# Altium project MotorESC.PrjPcb
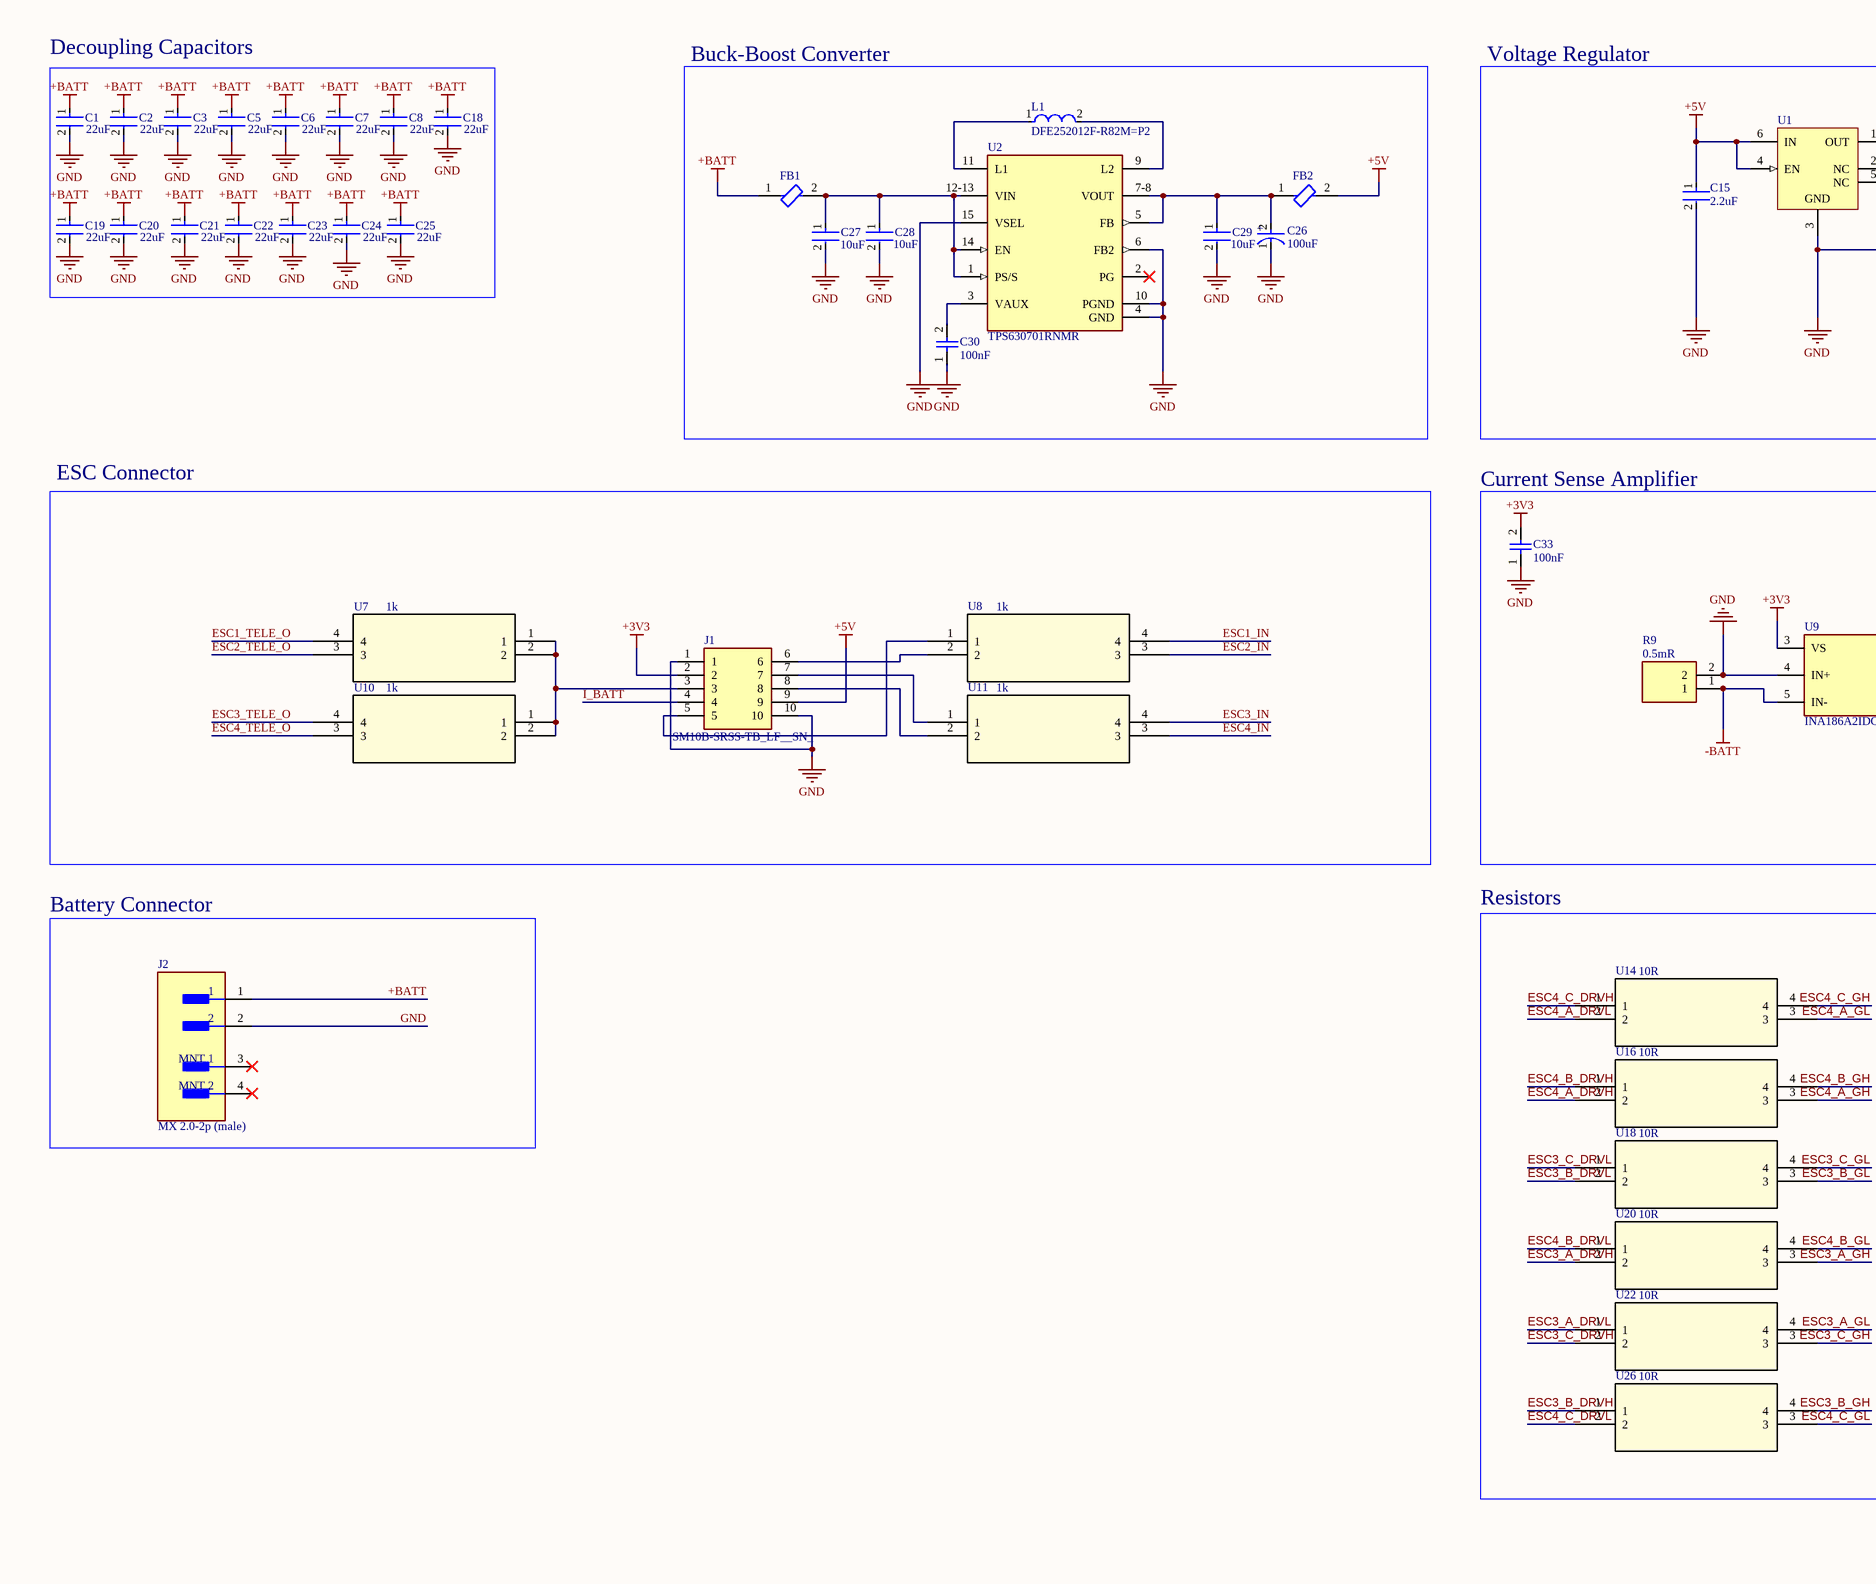
[diagram p0: ESC_Schematic.SchDoc, top left]
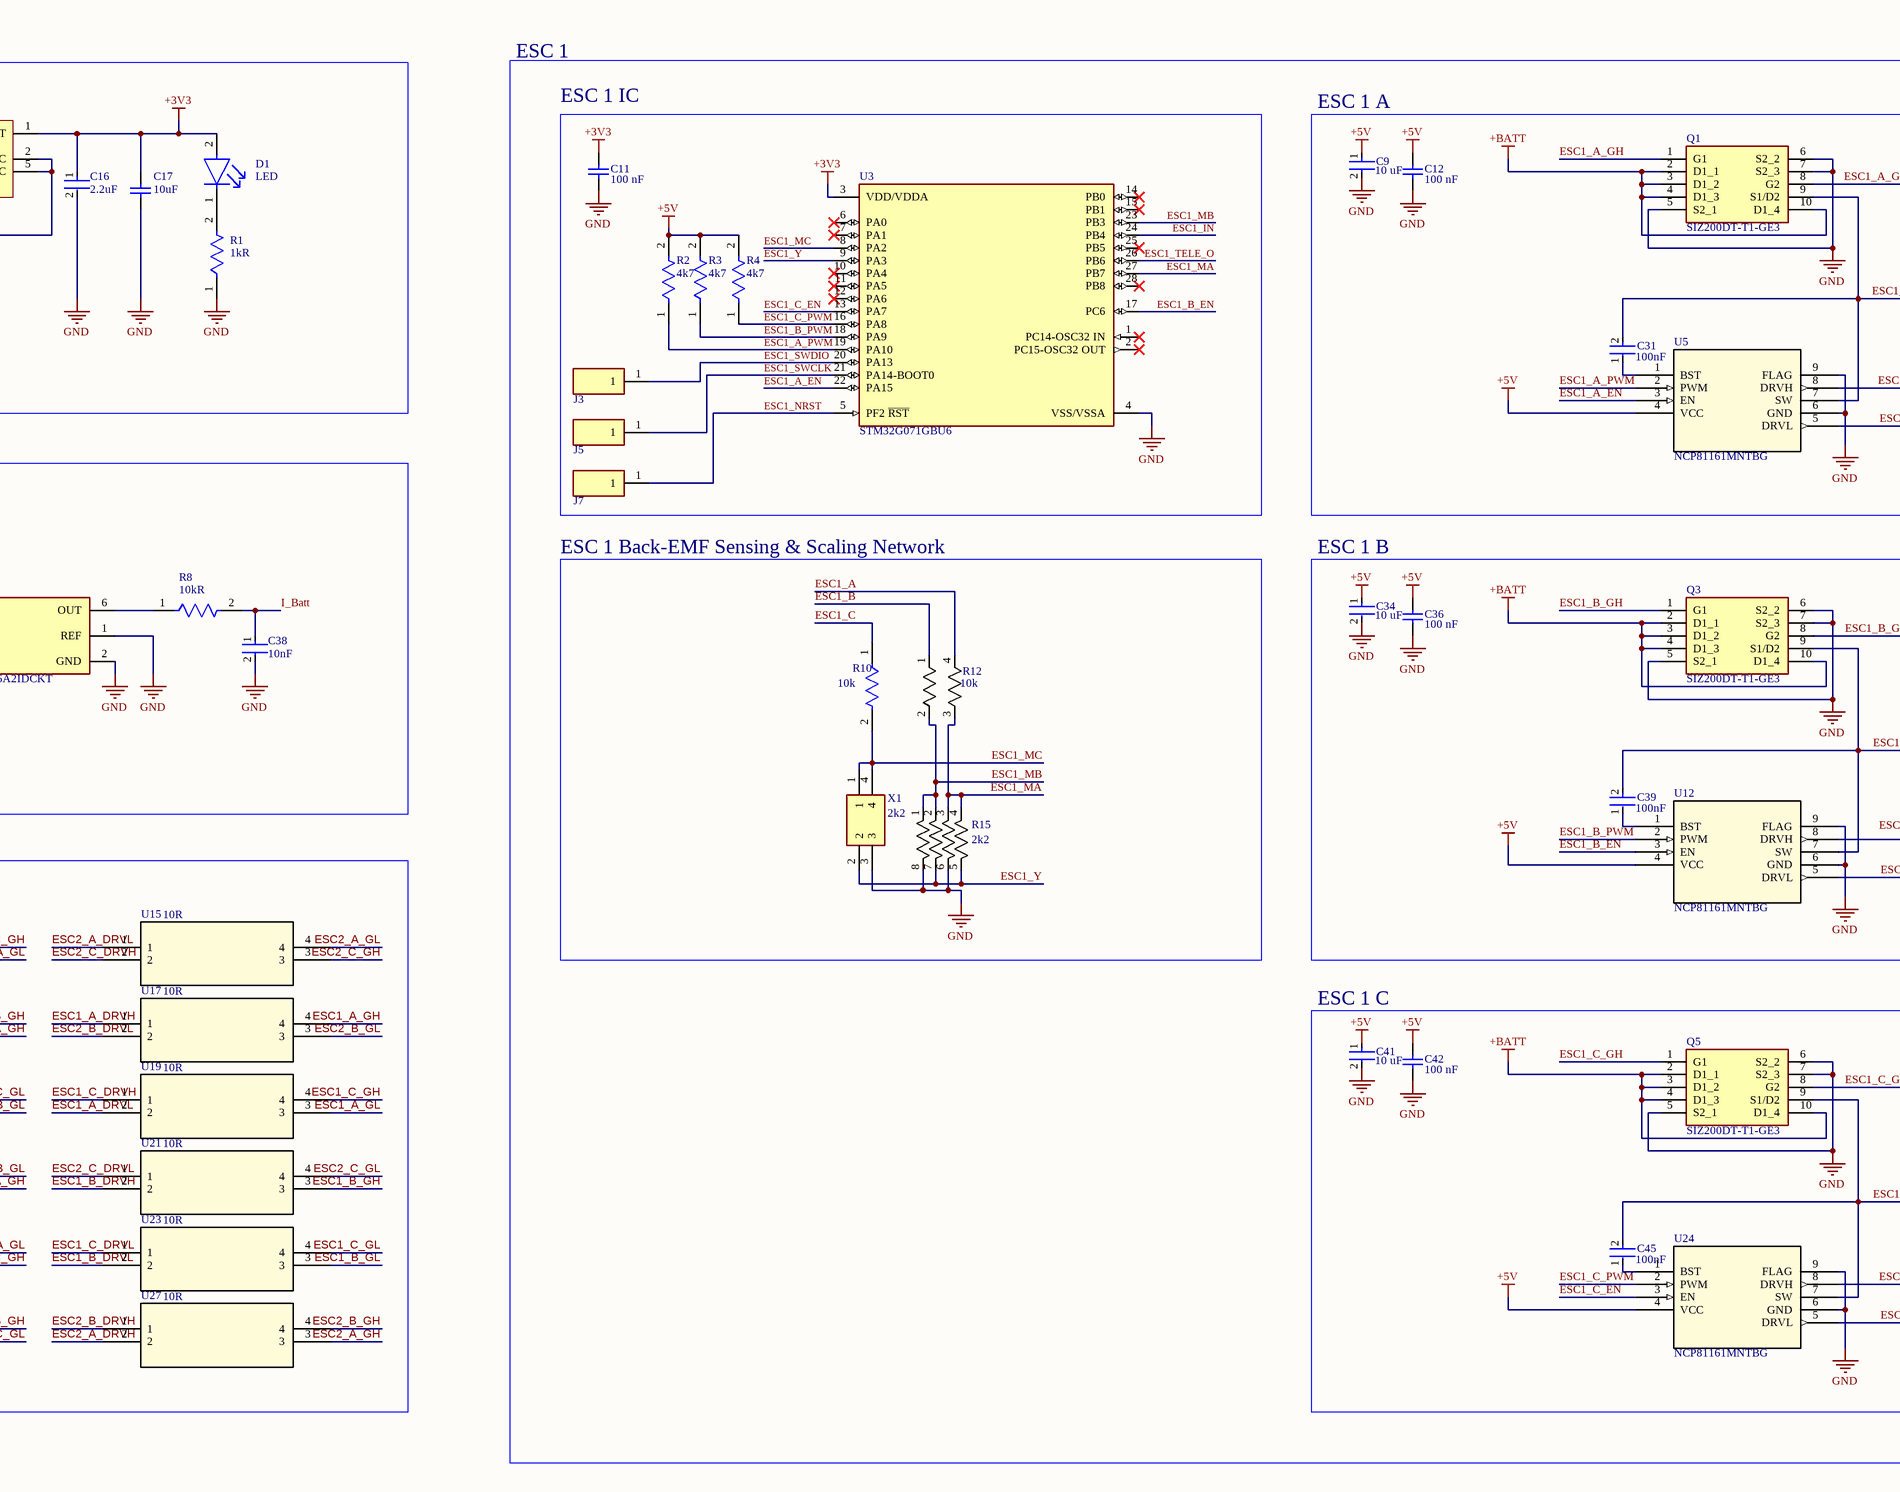
[diagram p1: ESC_Schematic.SchDoc, top middle]
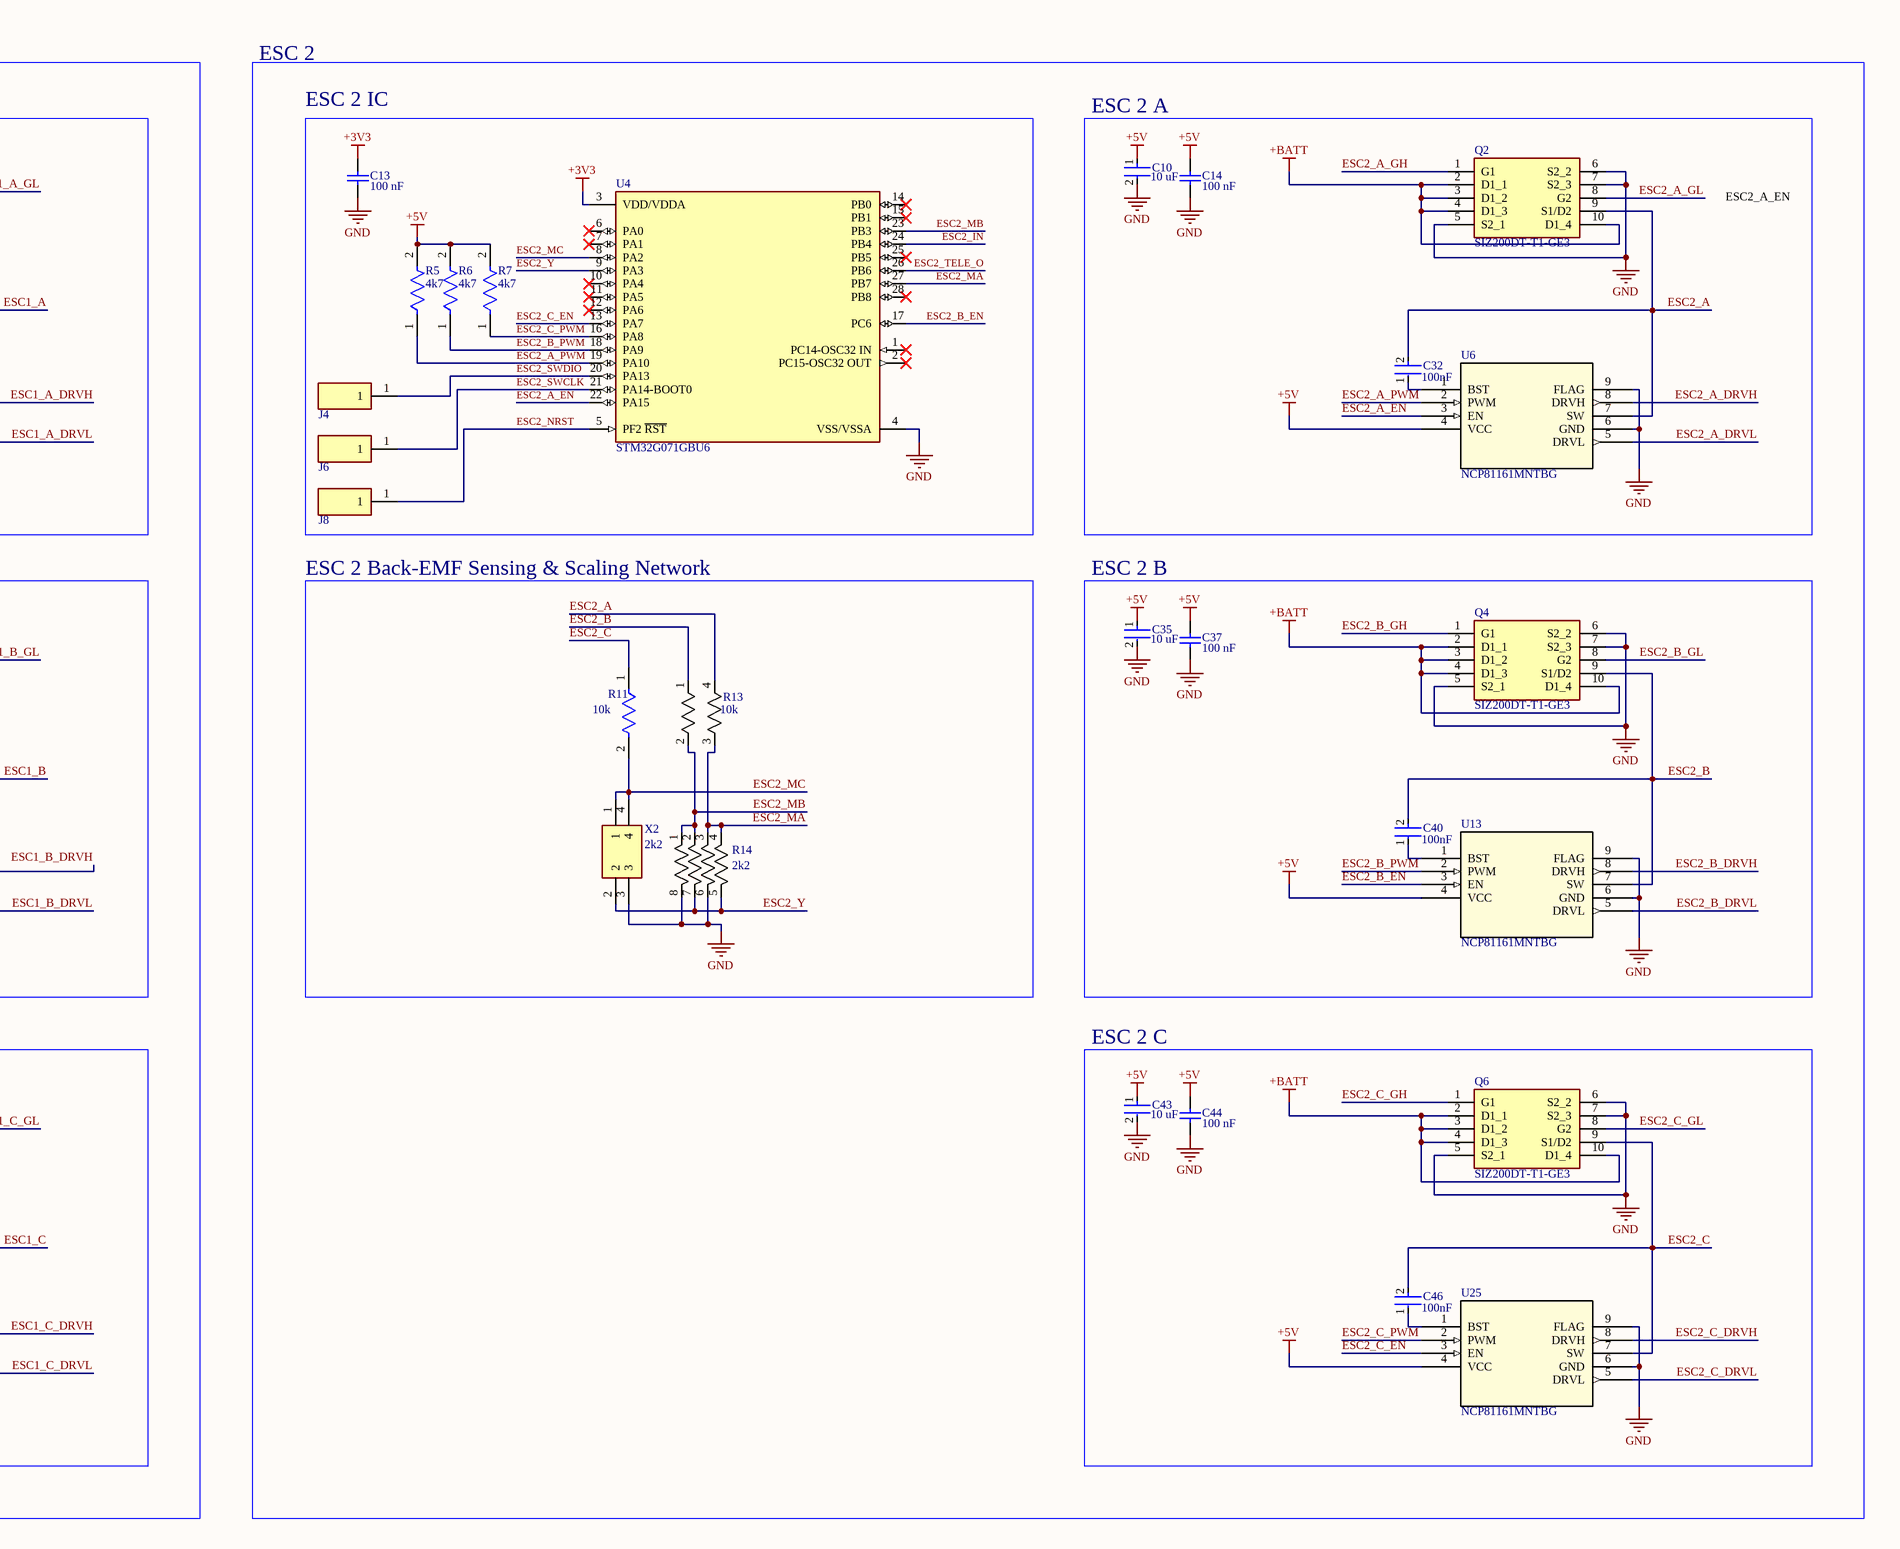
[diagram p2: ESC_Schematic.SchDoc, top right]
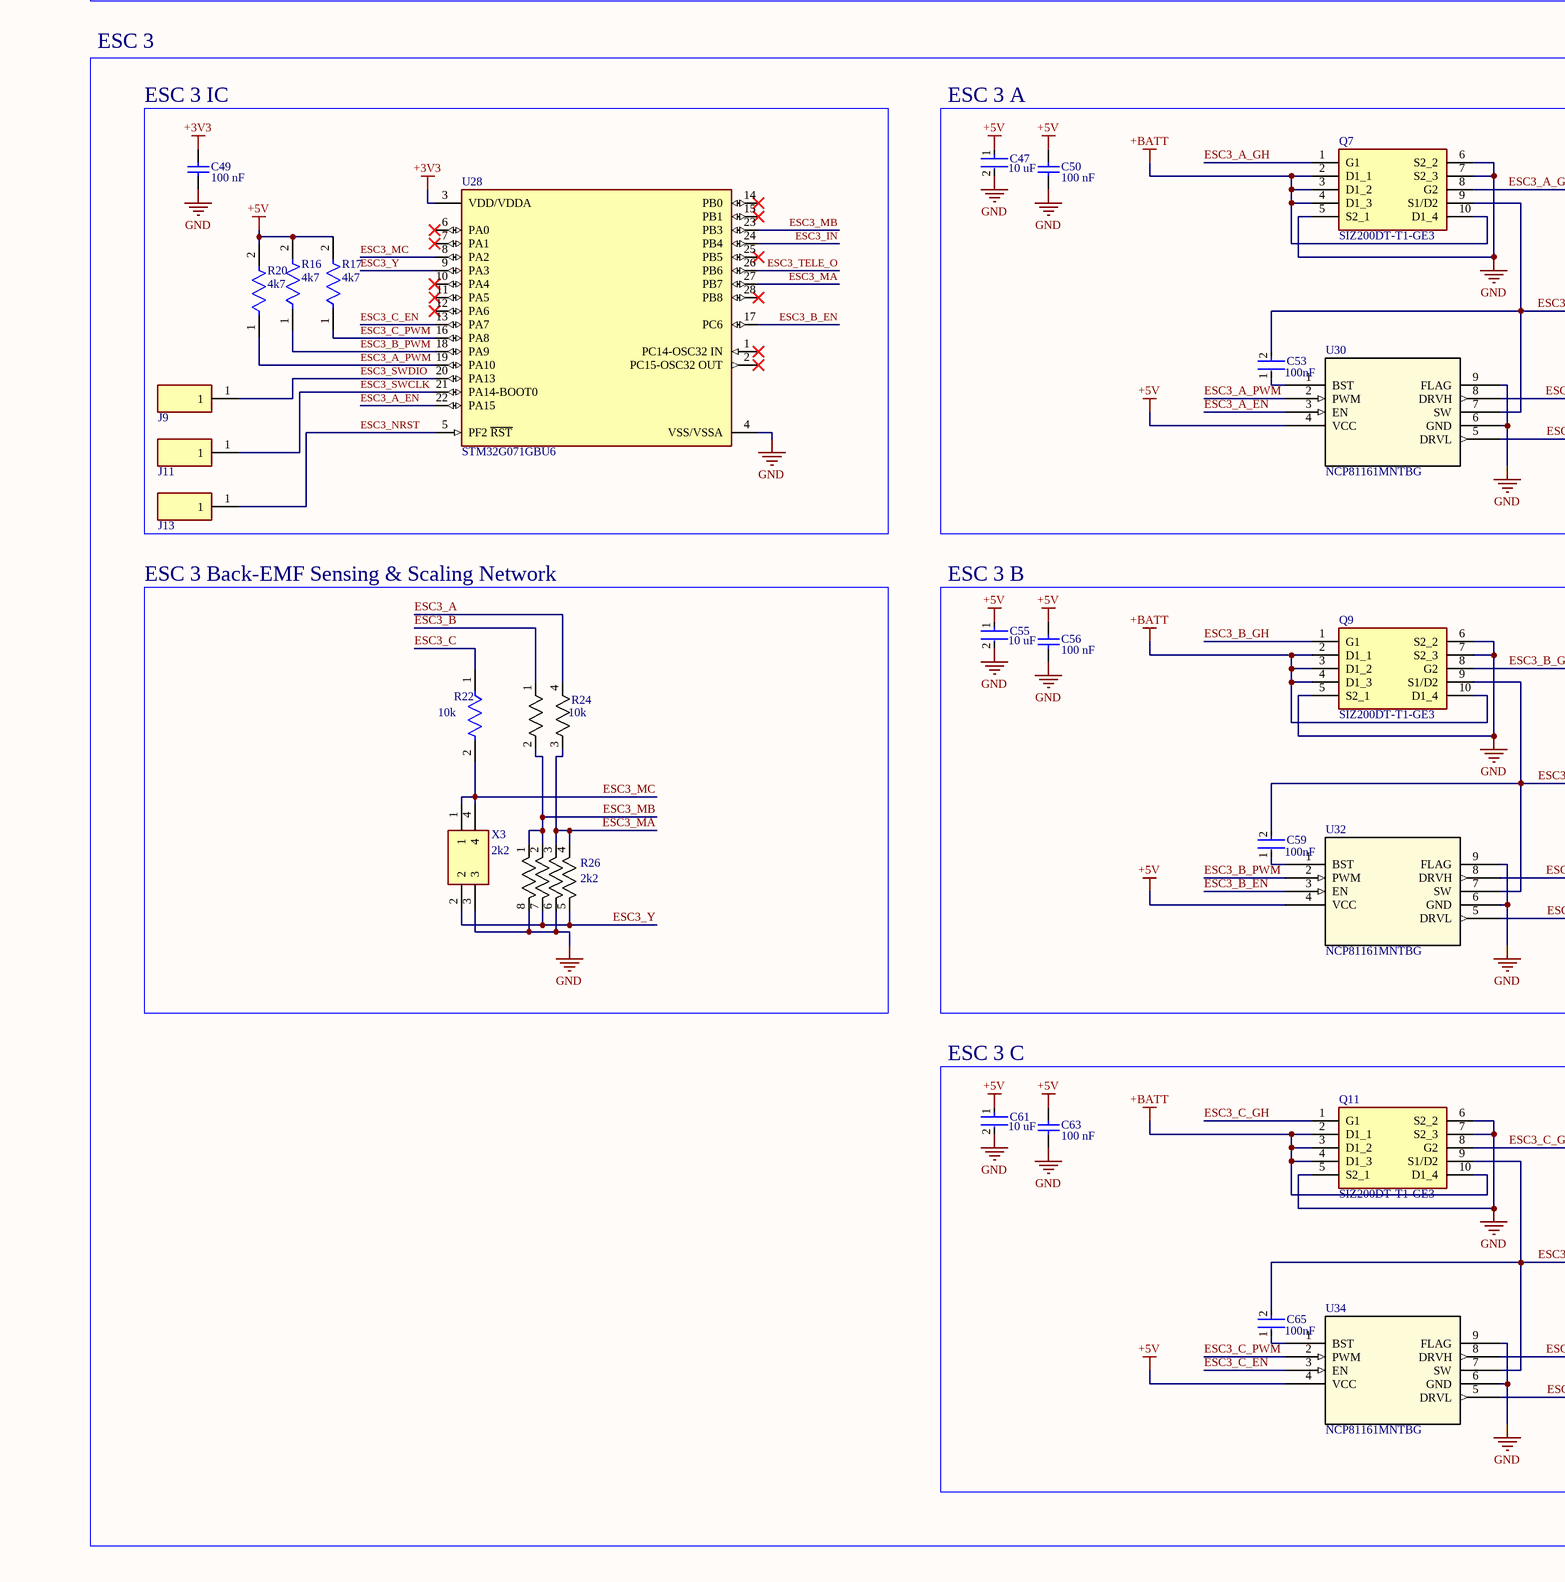
[diagram p3: ESC_Schematic.SchDoc, bottom middle]
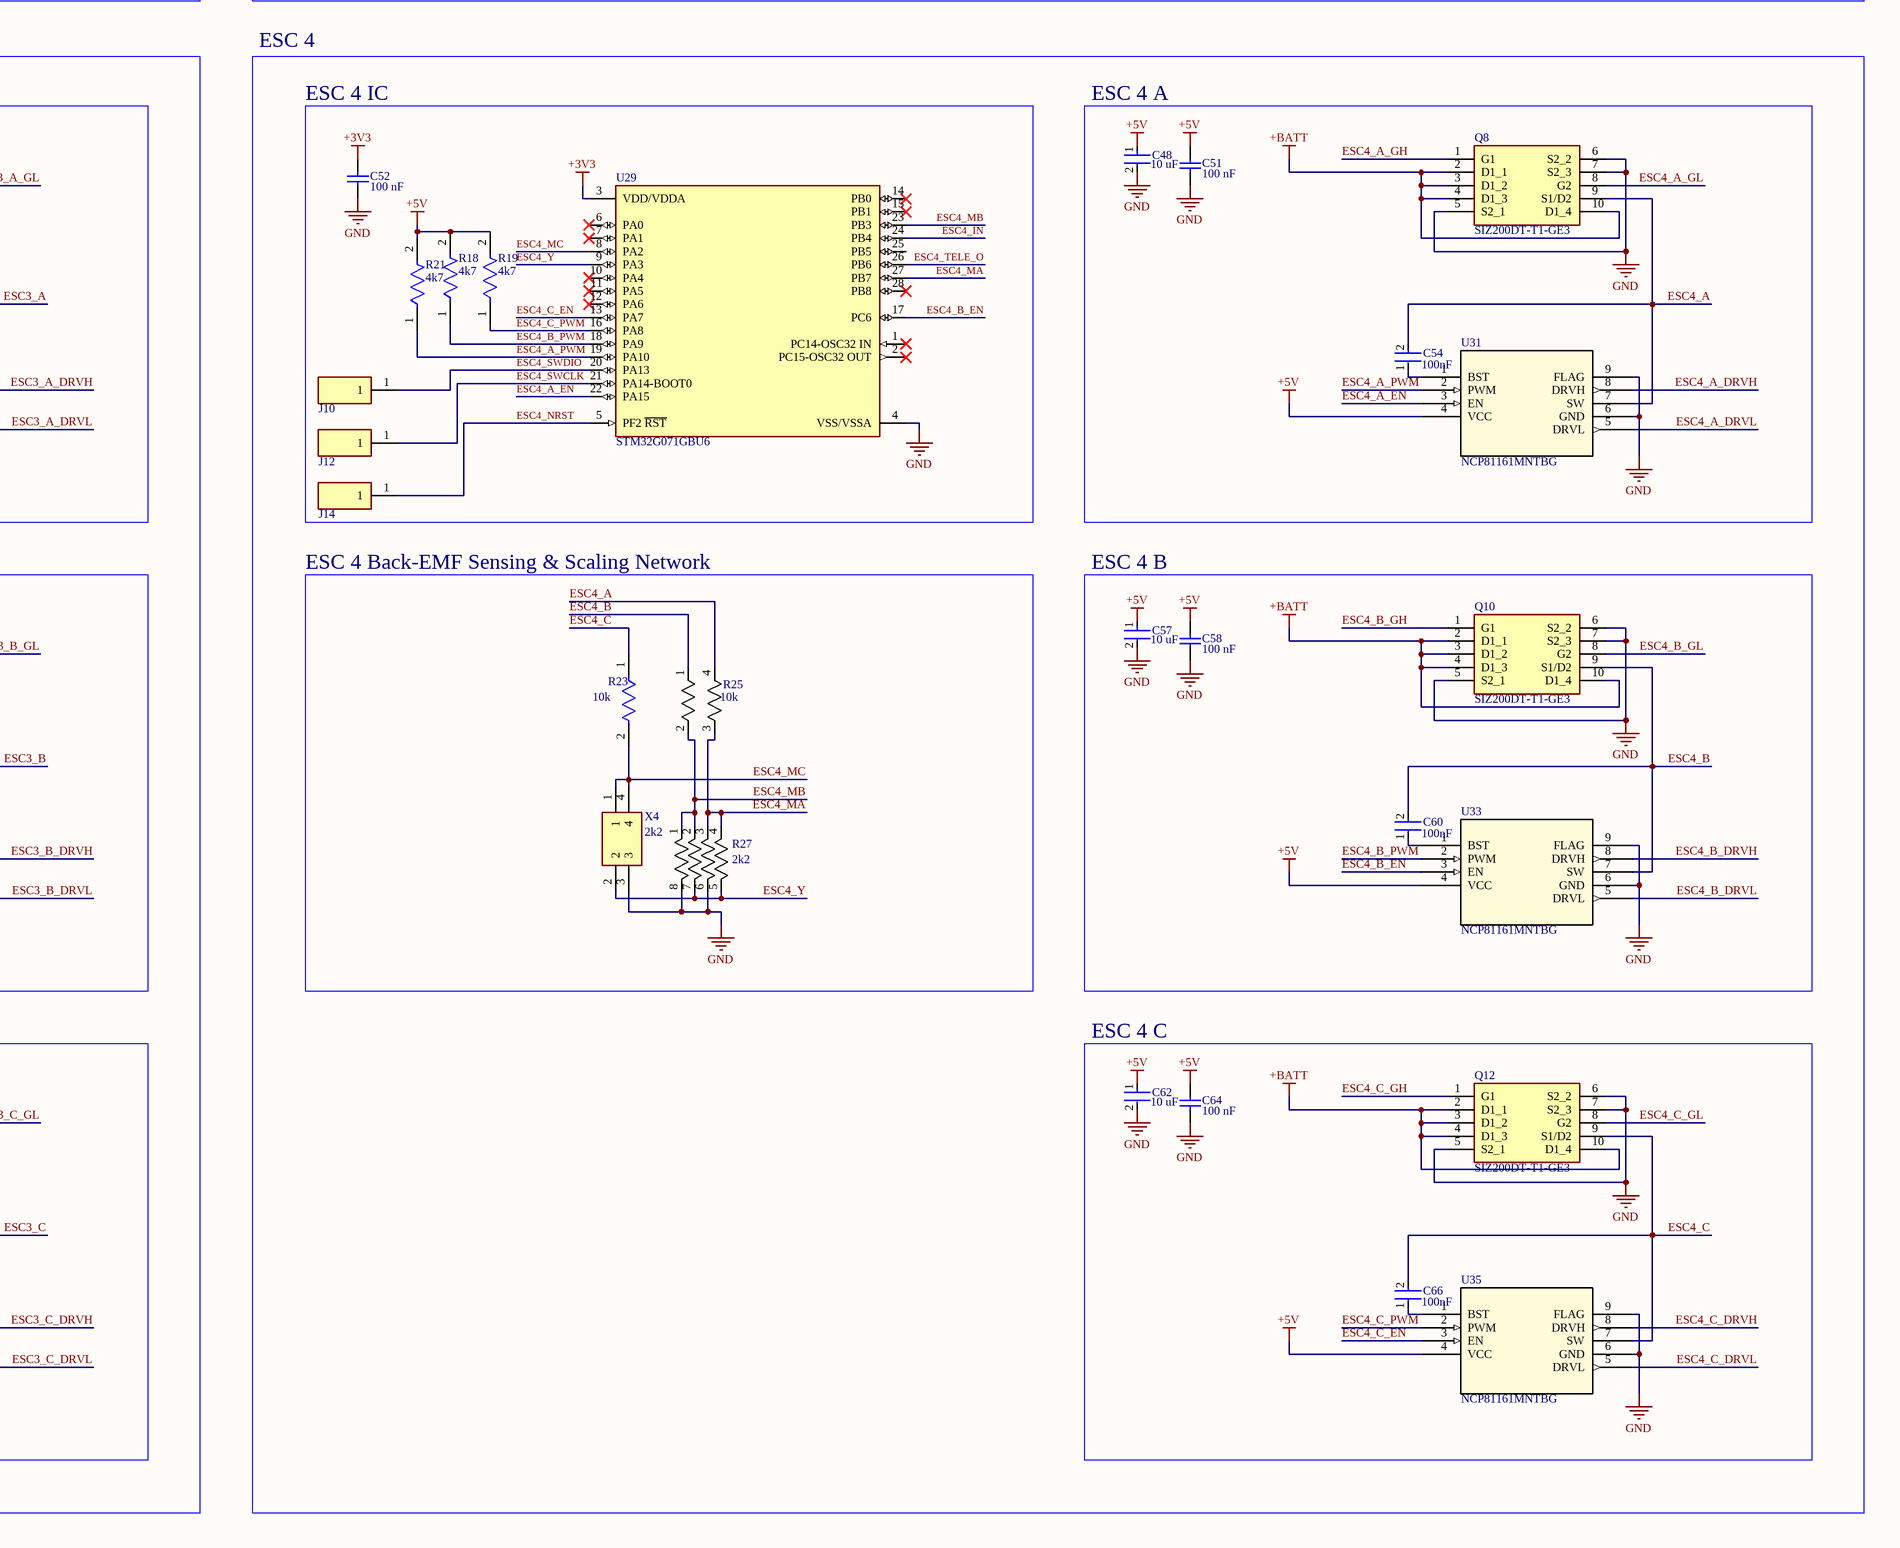
[diagram p4: ESC_Schematic.SchDoc, bottom right]
1 sheet, 161 parts. Net scope: global (net labels, ports and power ports of the same name join across sheets).
Board file: MotorESC.PcbDoc

## Sheet ESC_Schematic.SchDoc
size A0; SheetNumber: 1; SheetTotal: 1

### Parts
C1  Capacitance: 22uF  [FP-CC0805-0_2-1_45-IPC_C]  (hidden comment: CC0805MKX5R8BB226)
C2  Capacitance: 22uF  [FP-CC0805-0_2-1_45-IPC_C]  (hidden comment: CC0805MKX5R8BB226)
C3  Capacitance: 22uF  [FP-CC0805-0_2-1_45-IPC_C]  (hidden comment: CC0805MKX5R8BB226)
C5  Capacitance: 22uF  [FP-CC0805-0_2-1_45-IPC_C]  (hidden comment: CC0805MKX5R8BB226)
C6  Capacitance: 22uF  [FP-CC0805-0_2-1_45-IPC_C]  (hidden comment: CC0805MKX5R8BB226)
C7  Capacitance: 22uF  [FP-CC0805-0_2-1_45-IPC_C]  (hidden comment: CC0805MKX5R8BB226)
C8  Capacitance: 22uF  [FP-CC0805-0_2-1_45-IPC_C]  (hidden comment: CC0805MKX5R8BB226)
C9  Capacitance: 10 uF  [FP-GRM155-0_2-IPC_A]  (hidden comment: GRM155R61A106ME11D)
C10  Capacitance: 10 uF  [FP-GRM155-0_2-IPC_A]  (hidden comment: GRM155R61A106ME11D)
C11  Capacitance: 100 nF  [CAPC1005X56X25LL10T15]  (hidden comment: 04023C104JAT2A)
C12  Capacitance: 100 nF  [CAPC1005X56X25LL10T15]  (hidden comment: 04023C104JAT2A)
C13  Capacitance: 100 nF  [CAPC1005X56X25LL10T15]  (hidden comment: 04023C104JAT2A)
C14  Capacitance: 100 nF  [CAPC1005X56X25LL10T15]  (hidden comment: 04023C104JAT2A)
C15  Capacitance: 2.2uF  [FP-1210-L_3_3_0_4-W_2_5_0-IPC_C]  (hidden comment: 12101C225KAZ2A)
C16  Capacitance: 2.2uF  [FP-1210-L_3_3_0_4-W_2_5_0-IPC_C]  (hidden comment: 12101C225KAZ2A)
C17  value 10uF  [CAPC1206(3216)190_L]  (hidden comment: CAP 10uF 16V 1206(3216))
C18  Capacitance: 22uF  [FP-CC0805-0_2-1_45-IPC_C]  (hidden comment: CC0805MKX5R8BB226)
C19  Capacitance: 22uF  [FP-CC0805-0_2-1_45-IPC_C]  (hidden comment: CC0805MKX5R8BB226)
C20  Capacitance: 22uF  [FP-CC0805-0_2-1_45-IPC_C]  (hidden comment: CC0805MKX5R8BB226)
C21  Capacitance: 22uF  [FP-CC0805-0_2-1_45-IPC_C]  (hidden comment: CC0805MKX5R8BB226)
C22  Capacitance: 22uF  [FP-CC0805-0_2-1_45-IPC_C]  (hidden comment: CC0805MKX5R8BB226)
C23  Capacitance: 22uF  [FP-CC0805-0_2-1_45-IPC_C]  (hidden comment: CC0805MKX5R8BB226)
C24  Capacitance: 22uF  [FP-CC0805-0_2-1_45-IPC_C]  (hidden comment: CC0805MKX5R8BB226)
C25  Capacitance: 22uF  [FP-CC0805-0_2-1_45-IPC_C]  (hidden comment: CC0805MKX5R8BB226)
C26  Capacitance: 100uF  [FP-T520A107M006ATE045-MFG]  (hidden comment: T520A107M006ATE045)
C27  Capacitance: 10uF  [FP-GRM21B-0_15-IPC_A]  (hidden comment: GRM21BR61E106MA73L)
C28  Capacitance: 10uF  [FP-GRM188-0_2-IPC_B]  (hidden comment: GRM188R61E106KA73J)
C29  Capacitance: 10uF  [FP-GRM188-0_2-IPC_B]  (hidden comment: GRM188R61E106KA73J)
C30  value 100nF  [CAPC0402(1005)60_L]  (hidden comment: CAP 100nF 25V 0402(1005))
C31  Capactiance: 100nF  [FP-GCJ188-0_2-IPC_B]  (hidden comment: GCJ188R71C104MA01D)
C32  Capactiance: 100nF  [FP-GCJ188-0_2-IPC_B]  (hidden comment: GCJ188R71C104MA01D)
C33  value 100nF  [CAPC0402(1005)60_L]  (hidden comment: CAP 100nF 25V 0402(1005))
C34  Capacitance: 10 uF  [FP-GRM155-0_2-IPC_A]  (hidden comment: GRM155R61A106ME11D)
C35  Capacitance: 10 uF  [FP-GRM155-0_2-IPC_A]  (hidden comment: GRM155R61A106ME11D)
C36  Capacitance: 100 nF  [CAPC1005X56X25LL10T15]  (hidden comment: 04023C104JAT2A)
C37  Capacitance: 100 nF  [CAPC1005X56X25LL10T15]  (hidden comment: 04023C104JAT2A)
C38  Capacitance Value: 10nF  [FP-C0402-BB-MFG]  (hidden comment: C0402C103K5RACTU)
C39  Capactiance: 100nF  [FP-GCJ188-0_2-IPC_B]  (hidden comment: GCJ188R71C104MA01D)
C40  Capactiance: 100nF  [FP-GCJ188-0_2-IPC_B]  (hidden comment: GCJ188R71C104MA01D)
C41  Capacitance: 10 uF  [FP-GRM155-0_2-IPC_A]  (hidden comment: GRM155R61A106ME11D)
C42  Capacitance: 100 nF  [CAPC1005X56X25LL10T15]  (hidden comment: 04023C104JAT2A)
C43  Capacitance: 10 uF  [FP-GRM155-0_2-IPC_A]  (hidden comment: GRM155R61A106ME11D)
C44  Capacitance: 100 nF  [CAPC1005X56X25LL10T15]  (hidden comment: 04023C104JAT2A)
C45  Capactiance: 100nF  [FP-GCJ188-0_2-IPC_B]  (hidden comment: GCJ188R71C104MA01D)
C46  Capactiance: 100nF  [FP-GCJ188-0_2-IPC_B]  (hidden comment: GCJ188R71C104MA01D)
C47  Capacitance: 10 uF  [FP-GRM155-0_2-IPC_A]  (hidden comment: GRM155R61A106ME11D)
C48  Capacitance: 10 uF  [FP-GRM155-0_2-IPC_A]  (hidden comment: GRM155R61A106ME11D)
C49  Capacitance: 100 nF  [CAPC1005X56X25LL10T15]  (hidden comment: 04023C104JAT2A)
C50  Capacitance: 100 nF  [CAPC1005X56X25LL10T15]  (hidden comment: 04023C104JAT2A)
C51  Capacitance: 100 nF  [CAPC1005X56X25LL10T15]  (hidden comment: 04023C104JAT2A)
C52  Capacitance: 100 nF  [CAPC1005X56X25LL10T15]  (hidden comment: 04023C104JAT2A)
C53  Capactiance: 100nF  [FP-GCJ188-0_2-IPC_B]  (hidden comment: GCJ188R71C104MA01D)
C54  Capactiance: 100nF  [FP-GCJ188-0_2-IPC_B]  (hidden comment: GCJ188R71C104MA01D)
C55  Capacitance: 10 uF  [FP-GRM155-0_2-IPC_A]  (hidden comment: GRM155R61A106ME11D)
C56  Capacitance: 100 nF  [CAPC1005X56X25LL10T15]  (hidden comment: 04023C104JAT2A)
C57  Capacitance: 10 uF  [FP-GRM155-0_2-IPC_A]  (hidden comment: GRM155R61A106ME11D)
C58  Capacitance: 100 nF  [CAPC1005X56X25LL10T15]  (hidden comment: 04023C104JAT2A)
C59  Capactiance: 100nF  [FP-GCJ188-0_2-IPC_B]  (hidden comment: GCJ188R71C104MA01D)
C60  Capactiance: 100nF  [FP-GCJ188-0_2-IPC_B]  (hidden comment: GCJ188R71C104MA01D)
C61  Capacitance: 10 uF  [FP-GRM155-0_2-IPC_A]  (hidden comment: GRM155R61A106ME11D)
C62  Capacitance: 10 uF  [FP-GRM155-0_2-IPC_A]  (hidden comment: GRM155R61A106ME11D)
C63  Capacitance: 100 nF  [CAPC1005X56X25LL10T15]  (hidden comment: 04023C104JAT2A)
C64  Capacitance: 100 nF  [CAPC1005X56X25LL10T15]  (hidden comment: 04023C104JAT2A)
C65  Capactiance: 100nF  [FP-GCJ188-0_2-IPC_B]  (hidden comment: GCJ188R71C104MA01D)
C66  Capactiance: 100nF  [FP-GCJ188-0_2-IPC_B]  (hidden comment: GCJ188R71C104MA01D)
D1  Name: LED  [FP-HSMW-C191-0]  (hidden comment: HSMW-C191)
FB1  BLM18SG221TN1D  [FP-BLM18-0_15-t0_5-IPC_A]  (value not drawn)
FB2  BLM18SG221TN1D  [FP-BLM18-0_15-t0_5-IPC_A]  (value not drawn)
J1  SM10B-SRSS-TB_LF__SN_  [SM10B-SRSS-TB]
J2  MX 2.0-2p (male)  [FP-B2B-PH-SM4-TBT_LF_SN-MFG]
J3  9931-0-00-15-00-00-03-0  [9931000150000030]  (value not drawn)
J4  9931-0-00-15-00-00-03-0  [9931000150000030]  (value not drawn)
J5  9931-0-00-15-00-00-03-0  [9931000150000030]  (value not drawn)
J6  9931-0-00-15-00-00-03-0  [9931000150000030]  (value not drawn)
J7  9931-0-00-15-00-00-03-0  [9931000150000030]  (value not drawn)
J8  9931-0-00-15-00-00-03-0  [9931000150000030]  (value not drawn)
J9  9931-0-00-15-00-00-03-0  [9931000150000030]  (value not drawn)
J10  9931-0-00-15-00-00-03-0  [9931000150000030]  (value not drawn)
J11  9931-0-00-15-00-00-03-0  [9931000150000030]  (value not drawn)
J12  9931-0-00-15-00-00-03-0  [9931000150000030]  (value not drawn)
J13  9931-0-00-15-00-00-03-0  [9931000150000030]  (value not drawn)
J14  9931-0-00-15-00-00-03-0  [9931000150000030]  (value not drawn)
L1  DFE252012F-R82M=P2  [FP-DFE252012C-IPC_B]
Q1  SIZ200DT-T1-GE3  [SIZ200DTT1GE3]
Q2  SIZ200DT-T1-GE3  [SIZ200DTT1GE3]
Q3  SIZ200DT-T1-GE3  [SIZ200DTT1GE3]
Q4  SIZ200DT-T1-GE3  [SIZ200DTT1GE3]
Q5  SIZ200DT-T1-GE3  [SIZ200DTT1GE3]
Q6  SIZ200DT-T1-GE3  [SIZ200DTT1GE3]
Q7  SIZ200DT-T1-GE3  [SIZ200DTT1GE3]
Q8  SIZ200DT-T1-GE3  [SIZ200DTT1GE3]
Q9  SIZ200DT-T1-GE3  [SIZ200DTT1GE3]
Q10  SIZ200DT-T1-GE3  [SIZ200DTT1GE3]
Q11  SIZ200DT-T1-GE3  [SIZ200DTT1GE3]
Q12  SIZ200DT-T1-GE3  [SIZ200DTT1GE3]
R1  Resistance: 1kR  [FP-MCS0402-IPC_C]  (hidden comment: MCS04020C1001FE000)
R2  Resistance: 4k7  [FP-AC0402-MFG]  (hidden comment: AC0402FR-7W4K7L)
R3  Resistance: 4k7  [FP-AC0402-MFG]  (hidden comment: AC0402FR-7W4K7L)
R4  Resistance: 4k7  [FP-AC0402-MFG]  (hidden comment: AC0402FR-7W4K7L)
R5  Resistance: 4k7  [FP-AC0402-MFG]  (hidden comment: AC0402FR-7W4K7L)
R6  Resistance: 4k7  [FP-AC0402-MFG]  (hidden comment: AC0402FR-7W4K7L)
R7  Resistance: 4k7  [FP-AC0402-MFG]  (hidden comment: AC0402FR-7W4K7L)
R8  Resistance: 10kR  [FP-CRG0402-IPC_B]  (hidden comment: CRG0402F10K)
R9  Resistance: 0.5mR  [HCS1206FTL300]  (hidden comment: HCS1206FTL500)
R10  Resistance: 10k  [FP-CRG0402-IPC_B]  (hidden comment: CRG0402F10K)
R11  Resistance: 10k  [FP-CRG0402-IPC_B]  (hidden comment: CRG0402F10K)
R12  Resistance: 10k  [RM2012_SUS]  (hidden comment: RM2012B-103103-PBVW10)
R13  Resistance: 10k  [RM2012_SUS]  (hidden comment: RM2012B-103103-PBVW10)
R14  Resistance: 2k2  [BO_CAY10_PAN]  (hidden comment: CAY10-222J4LF)
R15  Resistance: 2k2  [BO_CAY10_PAN]  (hidden comment: CAY10-222J4LF)
R16  Resistance: 4k7  [FP-AC0402-MFG]  (hidden comment: AC0402FR-7W4K7L)
R17  Resistance: 4k7  [FP-AC0402-MFG]  (hidden comment: AC0402FR-7W4K7L)
R18  Resistance: 4k7  [FP-AC0402-MFG]  (hidden comment: AC0402FR-7W4K7L)
R19  Resistance: 4k7  [FP-AC0402-MFG]  (hidden comment: AC0402FR-7W4K7L)
R20  Resistance: 4k7  [FP-AC0402-MFG]  (hidden comment: AC0402FR-7W4K7L)
R21  Resistance: 4k7  [FP-AC0402-MFG]  (hidden comment: AC0402FR-7W4K7L)
R22  Resistance: 10k  [FP-CRG0402-IPC_B]  (hidden comment: CRG0402F10K)
R23  Resistance: 10k  [FP-CRG0402-IPC_B]  (hidden comment: CRG0402F10K)
R24  Resistance: 10k  [RM2012_SUS]  (hidden comment: RM2012B-103103-PBVW10)
R25  Resistance: 10k  [RM2012_SUS]  (hidden comment: RM2012B-103103-PBVW10)
R26  Resistance: 2k2  [BO_CAY10_PAN]  (hidden comment: CAY10-222J4LF)
R27  Resistance: 2k2  [BO_CAY10_PAN]  (hidden comment: CAY10-222J4LF)
U1  TPS72733DSER  [DES0006A_V]  (value not drawn)
U2  TPS630701RNMR  [FP-RNM0015A-MFG]
U3  STM32G071GBU6  [FP-UFQFPN28-A0B0-MFG]
U4  STM32G071GBU6  [FP-UFQFPN28-A0B0-MFG]
U5  NCP81161MNTBG  [DFN8_2X2_ONS]
U6  NCP81161MNTBG  [DFN8_2X2_ONS]
U7  Resistance: 1k  [C_ARRAY_EXB24V_PAN]  (hidden comment: EXB24V102JX)
U8  Resistance: 1k  [C_ARRAY_EXB24V_PAN]  (hidden comment: EXB24V102JX)
U9  INA186A2IDCKT  [FP-DCK0006A-IPC_A]
U10  Resistance: 1k  [C_ARRAY_EXB24V_PAN]  (hidden comment: EXB24V102JX)
U11  Resistance: 1k  [C_ARRAY_EXB24V_PAN]  (hidden comment: EXB24V102JX)
U12  NCP81161MNTBG  [DFN8_2X2_ONS]
U13  NCP81161MNTBG  [DFN8_2X2_ONS]
U14  Restistance: 10R  [C_ARRAY_EXB24V_PAN]  (hidden comment: EXB24V100JX)
U15  Restistance: 10R  [C_ARRAY_EXB24V_PAN]  (hidden comment: EXB24V100JX)
U16  Restistance: 10R  [C_ARRAY_EXB24V_PAN]  (hidden comment: EXB24V100JX)
U17  Restistance: 10R  [C_ARRAY_EXB24V_PAN]  (hidden comment: EXB24V100JX)
U18  Restistance: 10R  [C_ARRAY_EXB24V_PAN]  (hidden comment: EXB24V100JX)
U19  Restistance: 10R  [C_ARRAY_EXB24V_PAN]  (hidden comment: EXB24V100JX)
U20  Restistance: 10R  [C_ARRAY_EXB24V_PAN]  (hidden comment: EXB24V100JX)
U21  Restistance: 10R  [C_ARRAY_EXB24V_PAN]  (hidden comment: EXB24V100JX)
U22  Restistance: 10R  [C_ARRAY_EXB24V_PAN]  (hidden comment: EXB24V100JX)
U23  Restistance: 10R  [C_ARRAY_EXB24V_PAN]  (hidden comment: EXB24V100JX)
U24  NCP81161MNTBG  [DFN8_2X2_ONS]
U25  NCP81161MNTBG  [DFN8_2X2_ONS]
U26  Restistance: 10R  [C_ARRAY_EXB24V_PAN]  (hidden comment: EXB24V100JX)
U27  Restistance: 10R  [C_ARRAY_EXB24V_PAN]  (hidden comment: EXB24V100JX)
U28  STM32G071GBU6  [FP-UFQFPN28-A0B0-MFG]
U29  STM32G071GBU6  [FP-UFQFPN28-A0B0-MFG]
U30  NCP81161MNTBG  [DFN8_2X2_ONS]
U31  NCP81161MNTBG  [DFN8_2X2_ONS]
U32  NCP81161MNTBG  [DFN8_2X2_ONS]
U33  NCP81161MNTBG  [DFN8_2X2_ONS]
U34  NCP81161MNTBG  [DFN8_2X2_ONS]
U35  NCP81161MNTBG  [DFN8_2X2_ONS]
X1  Resistance: 2k2  [741X043222JP]  (hidden comment: 741X043222JP)
X2  Resistance: 2k2  [741X043222JP]  (hidden comment: 741X043222JP)
X3  Resistance: 2k2  [741X043222JP]  (hidden comment: 741X043222JP)
X4  Resistance: 2k2  [741X043222JP]  (hidden comment: 741X043222JP)

### Blocks framed on the sheet
Decoupling Capacitors: C1-C3 C5-C8 C18-C25
Buck-Boost Converter: C26-C30 FB1 FB2 L1 U2
Voltage Regulator: C15-C17 D1 R1 U1
ESC 1 IC: C11 J3 J5 J7 R2-R4 U3
ESC 1 A: C9 C12 C31 Q1 U5
ESC 2 IC: C13 J4 J6 J8 R5-R7 U4
ESC 2 A: C10 C14 C32 Q2 U6
ESC Connector: J1 U7 U8 U10 U11
Current Sense Amplifier: C33 C38 R8 R9 U9
ESC 1 Back-EMF Sensing & Scaling Network: R10 R12 R15 X1
ESC 1 B: C34 C36 C39 Q3 U12
ESC 2 Back-EMF Sensing & Scaling Network: R11 R13 R14 X2
ESC 2 B: C35 C37 C40 Q4 U13
Battery Connector: J2
Resistors: U14-U23 U26 U27
ESC 1 C: C41 C42 C45 Q5 U24
ESC 2 C: C43 C44 C46 Q6 U25
ESC 3 IC: C49 J9 J11 J13 R16 R17 R20 U28
ESC 3 A: C47 C50 C53 Q7 U30
ESC 4 IC: C52 J10 J12 J14 R18 R19 R21 U29
ESC 4 A: C48 C51 C54 Q8 U31
ESC 3 Back-EMF Sensing & Scaling Network: R22 R24 R26 X3
ESC 3 B: C55 C56 C59 Q9 U32
ESC 4 Back-EMF Sensing & Scaling Network: R23 R25 R27 X4
ESC 4 B: C57 C58 C60 Q10 U33
ESC 3 C: C61 C63 C65 Q11 U34
ESC 4 C: C62 C64 C66 Q12 U35

### Nets
+3V3: C11.2 C13.2 C16.1 C17.2 C33.2 C49.2 C52.2 D1.2(A) J1.2 U1.1(OUT) U3.3(VDD/VDDA) U4.3(VDD/VDDA) U9.3(VS) U28.3(VDD/VDDA) U29.3(VDD/VDDA)
+5V: C9.1 C10.1 C12.2 C14.2 C15.1 C34.1 C35.1 C36.2 C37.2 C41.1 C42.2 C43.1 C44.2 C47.1 C48.1 C50.2 C51.2 C55.1 C56.2 C57.1 C58.2 C61.1 C62.1 C63.2 C64.2 FB2.2 J1.9 R2.2 R3.2 R4.2 R5.2 R6.2 R7.2 R16.2 R17.2 R18.2 R19.2 R20.2 R21.2 U1.4(EN) U1.6(IN) U5.4(VCC) U6.4(VCC) U12.4(VCC) U13.4(VCC) U24.4(VCC) U25.4(VCC) U30.4(VCC) U31.4(VCC) U32.4(VCC) U33.4(VCC) U34.4(VCC) U35.4(VCC)
+BATT: C1.1 C2.1 C3.1 C5.1 C6.1 C7.1 C8.1 C18.1 C19.1 C20.1 C21.1 C22.1 C23.1 C24.1 C25.1 FB1.1 J2.1 Q1.2(D1_1) Q1.3(D1_2) Q1.4(D1_3) Q1.10(D1_4) Q2.2(D1_1) Q2.3(D1_2) Q2.4(D1_3) Q2.10(D1_4) Q3.2(D1_1) Q3.3(D1_2) Q3.4(D1_3) Q3.10(D1_4) Q4.2(D1_1) Q4.3(D1_2) Q4.4(D1_3) Q4.10(D1_4) Q5.2(D1_1) Q5.3(D1_2) Q5.4(D1_3) Q5.10(D1_4) Q6.2(D1_1) Q6.3(D1_2) Q6.4(D1_3) Q6.10(D1_4) Q7.2(D1_1) Q7.3(D1_2) Q7.4(D1_3) Q7.10(D1_4) Q8.2(D1_1) Q8.3(D1_2) Q8.4(D1_3) Q8.10(D1_4) Q9.2(D1_1) Q9.3(D1_2) Q9.4(D1_3) Q9.10(D1_4) Q10.2(D1_1) Q10.3(D1_2) Q10.4(D1_3) Q10.10(D1_4) Q11.2(D1_1) Q11.3(D1_2) Q11.4(D1_3) Q11.10(D1_4) Q12.2(D1_1) Q12.3(D1_2) Q12.4(D1_3) Q12.10(D1_4)
-BATT: R9.1 U9.5(IN-)
GND: C1.2 C2.2 C3.2 C5.2 C6.2 C7.2 C8.2 C9.2 C10.2 C11.1 C12.1 C13.1 C14.1 C15.2 C16.2 C17.1 C18.2 C19.2 C20.2 C21.2 C22.2 C23.2 C24.2 C25.2 C26.1(C) C27.2 C28.2 C29.2 C30.1 C33.1 C34.2 C35.2 C36.1 C37.1 C38.2 C41.2 C42.1 C43.2 C44.1 C47.2 C48.2 C49.1 C50.1 C51.1 C52.1 C55.2 C56.1 C57.2 C58.1 C61.2 C62.2 C63.1 C64.1 J1.1 J1.10 J2.2 Q1.5(S2_1) Q1.6(S2_2) Q1.7(S2_3) Q2.5(S2_1) Q2.6(S2_2) Q2.7(S2_3) Q3.5(S2_1) Q3.6(S2_2) Q3.7(S2_3) Q4.5(S2_1) Q4.6(S2_2) Q4.7(S2_3) Q5.5(S2_1) Q5.6(S2_2) Q5.7(S2_3) Q6.5(S2_1) Q6.6(S2_2) Q6.7(S2_3) Q7.5(S2_1) Q7.6(S2_2) Q7.7(S2_3) Q8.5(S2_1) Q8.6(S2_2) Q8.7(S2_3) Q9.5(S2_1) Q9.6(S2_2) Q9.7(S2_3) Q10.5(S2_1) Q10.6(S2_2) Q10.7(S2_3) Q11.5(S2_1) Q11.6(S2_2) Q11.7(S2_3) Q12.5(S2_1) Q12.6(S2_2) Q12.7(S2_3) R1.1 R9.2 R14.6 R14.8 R15.6 R15.8 R26.6 R26.8 R27.6 R27.8 U1.2(NC) U1.3(GND) U1.5(NC) U2.4(GND) U2.6(FB2) U2.10(PGND) U2.15(VSEL) U3.4(VSS/VSSA) U4.4(VSS/VSSA) U5.6(GND) U5.9(FLAG) U6.6(GND) U6.9(FLAG) U9.1(REF) U9.2(GND) U9.4(IN+) U12.6(GND) U12.9(FLAG) U13.6(GND) U13.9(FLAG) U24.6(GND) U24.9(FLAG) U25.6(GND) U25.9(FLAG) U28.4(VSS/VSSA) U29.4(VSS/VSSA) U30.6(GND) U30.9(FLAG) U31.6(GND) U31.9(FLAG) U32.6(GND) U32.9(FLAG) U33.6(GND) U33.9(FLAG) U34.6(GND) U34.9(FLAG) U35.6(GND) U35.9(FLAG) X1.3 X2.3 X3.3 X4.3
ESC1_A: C31.2 Q1.9(S1/D2) R12.4 U5.7(SW)
ESC1_A_DRVH: U5.8(DRVH) U17.1
ESC1_A_DRVL: U5.5(DRVL) U19.2
ESC1_A_EN: U3.22(PA15) U5.3(EN)
ESC1_A_GH: Q1.1(G1) U17.4
ESC1_A_GL: Q1.8(G2) U19.3
ESC1_A_PWM: R2.1 U3.19(PA10) U5.2(PWM)
ESC1_B: C39.2 Q3.9(S1/D2) R12.1 U12.7(SW)
ESC1_B_DRVH: U12.8(DRVH) U21.2
ESC1_B_DRVL: U12.5(DRVL) U23.2
ESC1_B_EN: U3.17(PC6) U12.3(EN)
ESC1_B_GH: Q3.1(G1) U21.3
ESC1_B_GL: Q3.8(G2) U23.3
ESC1_B_PWM: R3.1 U3.18(PA9) U12.2(PWM)
ESC1_C: C45.2 Q5.9(S1/D2) R10.1 U24.7(SW)
ESC1_C_DRVH: U19.1 U24.8(DRVH)
ESC1_C_DRVL: U23.1 U24.5(DRVL)
ESC1_C_EN: U3.13(PA7) U24.3(EN)
ESC1_C_GH: Q5.1(G1) U19.4
ESC1_C_GL: Q5.8(G2) U23.4
ESC1_C_PWM: R4.1 U3.16(PA8) U24.2(PWM)
ESC1_IN: U3.24(PB4) U8.4
ESC1_MA: R12.3 R15.3 R15.4 U3.27(PB7)
ESC1_MB: R12.2 R15.1 R15.2 U3.23(PB3)
ESC1_MC: R10.2 U3.8(PA2) X1.1 X1.4
ESC1_NRST: J7.1 U3.5(PF2_~{RST})
ESC1_SWCLK: J5.1 U3.21(PA14-BOOT0)
ESC1_SWDIO: J3.1 U3.20(PA13)
ESC1_TELE_O: U3.26(PB6) U7.4
ESC1_Y: R15.5 R15.7 U3.9(PA3) X1.2
ESC2_A: C32.2 Q2.9(S1/D2) R13.4 U6.7(SW)
ESC2_A_DRVH: U6.8(DRVH) U27.2
ESC2_A_DRVL: U6.5(DRVL) U15.1
ESC2_A_EN: U4.22(PA15) U6.3(EN)
ESC2_A_GH: Q2.1(G1) U27.3
ESC2_A_GL: Q2.8(G2) U15.4
ESC2_A_PWM: R5.1 U4.19(PA10) U6.2(PWM)
ESC2_B: C40.2 Q4.9(S1/D2) R13.1 U13.7(SW)
ESC2_B_DRVH: U13.8(DRVH) U27.1
ESC2_B_DRVL: U13.5(DRVL) U17.2
ESC2_B_EN: U4.17(PC6) U13.3(EN)
ESC2_B_GH: Q4.1(G1) U27.4
ESC2_B_GL: Q4.8(G2) U17.3
ESC2_B_PWM: R6.1 U4.18(PA9) U13.2(PWM)
ESC2_C: C46.2 Q6.9(S1/D2) R11.1 U25.7(SW)
ESC2_C_DRVH: U15.2 U25.8(DRVH)
ESC2_C_DRVL: U21.1 U25.5(DRVL)
ESC2_C_EN: U4.13(PA7) U25.3(EN)
ESC2_C_GH: Q6.1(G1) U15.3
ESC2_C_GL: Q6.8(G2) U21.4
ESC2_C_PWM: R7.1 U4.16(PA8) U25.2(PWM)
ESC2_IN: U4.24(PB4) U8.3
ESC2_MA: R13.3 R14.3 R14.4 U4.27(PB7)
ESC2_MB: R13.2 R14.1 R14.2 U4.23(PB3)
ESC2_MC: R11.2 U4.8(PA2) X2.1 X2.4
ESC2_NRST: J8.1 U4.5(PF2_~{RST})
ESC2_SWCLK: J6.1 U4.21(PA14-BOOT0)
ESC2_SWDIO: J4.1 U4.20(PA13)
ESC2_TELE_O: U4.26(PB6) U7.3
ESC2_Y: R14.5 R14.7 U4.9(PA3) X2.2
ESC3_A: C53.2 Q7.9(S1/D2) R24.4 U30.7(SW)
ESC3_A_DRVH: U20.2 U30.8(DRVH)
ESC3_A_DRVL: U22.1 U30.5(DRVL)
ESC3_A_EN: U28.22(PA15) U30.3(EN)
ESC3_A_GH: Q7.1(G1) U20.3
ESC3_A_GL: Q7.8(G2) U22.4
ESC3_A_PWM: R20.1 U28.19(PA10) U30.2(PWM)
ESC3_B: C59.2 Q9.9(S1/D2) R24.1 U32.7(SW)
ESC3_B_DRVH: U26.1 U32.8(DRVH)
ESC3_B_DRVL: U18.2 U32.5(DRVL)
ESC3_B_EN: U28.17(PC6) U32.3(EN)
ESC3_B_GH: Q9.1(G1) U26.4
ESC3_B_GL: Q9.8(G2) U18.3
ESC3_B_PWM: R16.1 U28.18(PA9) U32.2(PWM)
ESC3_C: C65.2 Q11.9(S1/D2) R22.1 U34.7(SW)
ESC3_C_DRVH: U22.2 U34.8(DRVH)
ESC3_C_DRVL: U18.1 U34.5(DRVL)
ESC3_C_EN: U28.13(PA7) U34.3(EN)
ESC3_C_GH: Q11.1(G1) U22.3
ESC3_C_GL: Q11.8(G2) U18.4
ESC3_C_PWM: R17.1 U28.16(PA8) U34.2(PWM)
ESC3_IN: U11.4 U28.24(PB4)
ESC3_MA: R24.3 R26.3 R26.4 U28.27(PB7)
ESC3_MB: R24.2 R26.1 R26.2 U28.23(PB3)
ESC3_MC: R22.2 U28.8(PA2) X3.1 X3.4
ESC3_NRST: J13.1 U28.5(PF2_~{RST})
ESC3_SWCLK: J11.1 U28.21(PA14-BOOT0)
ESC3_SWDIO: J9.1 U28.20(PA13)
ESC3_TELE_O: U10.4 U28.26(PB6)
ESC3_Y: R26.5 R26.7 U28.9(PA3) X3.2
ESC4_A: C54.2 Q8.9(S1/D2) R25.4 U31.7(SW)
ESC4_A_DRVH: U16.2 U31.8(DRVH)
ESC4_A_DRVL: U14.2 U31.5(DRVL)
ESC4_A_EN: U29.22(PA15) U31.3(EN)
ESC4_A_GH: Q8.1(G1) U16.3
ESC4_A_GL: Q8.8(G2) U14.3
ESC4_A_PWM: R21.1 U29.19(PA10) U31.2(PWM)
ESC4_B: C60.2 Q10.9(S1/D2) R25.1 U33.7(SW)
ESC4_B_DRVH: U16.1 U33.8(DRVH)
ESC4_B_DRVL: U20.1 U33.5(DRVL)
ESC4_B_EN: U29.17(PC6) U33.3(EN)
ESC4_B_GH: Q10.1(G1) U16.4
ESC4_B_GL: Q10.8(G2) U20.4
ESC4_B_PWM: R18.1 U29.18(PA9) U33.2(PWM)
ESC4_C: C66.2 Q12.9(S1/D2) R23.1 U35.7(SW)
ESC4_C_DRVH: U14.1 U35.8(DRVH)
ESC4_C_DRVL: U26.2 U35.5(DRVL)
ESC4_C_EN: U29.13(PA7) U35.3(EN)
ESC4_C_GH: Q12.1(G1) U14.4
ESC4_C_GL: Q12.8(G2) U26.3
ESC4_C_PWM: R19.1 U29.16(PA8) U35.2(PWM)
ESC4_IN: U11.3 U29.24(PB4)
ESC4_MA: R25.3 R27.3 R27.4 U29.27(PB7)
ESC4_MB: R25.2 R27.1 R27.2 U29.23(PB3)
ESC4_MC: R23.2 U29.8(PA2) X4.1 X4.4
ESC4_NRST: J14.1 U29.5(PF2_~{RST})
ESC4_SWCLK: J12.1 U29.21(PA14-BOOT0)
ESC4_SWDIO: J10.1 U29.20(PA13)
ESC4_TELE_O: U10.3 U29.26(PB6)
ESC4_Y: R27.5 R27.7 U29.9(PA3) X4.2
I_Batt: C38.1 J1.4 R8.2
NetC26_2: C26.2(A) C29.1 FB2.1 U2.5(FB) U2.7-8(VOUT)
NetC27_1: C27.1 C28.1 FB1.2 U2.1(PS/S) U2.12-13(VIN) U2.14(EN)
NetC30_2: C30.2 U2.3(VAUX)
NetC31_1: C31.1 U5.1(BST)
NetC32_1: C32.1 U6.1(BST)
NetC39_1: C39.1 U12.1(BST)
NetC40_1: C40.1 U13.1(BST)
NetC45_1: C45.1 U24.1(BST)
NetC46_1: C46.1 U25.1(BST)
NetC53_1: C53.1 U30.1(BST)
NetC54_1: C54.1 U31.1(BST)
NetC59_1: C59.1 U32.1(BST)
NetC60_1: C60.1 U33.1(BST)
NetC65_1: C65.1 U34.1(BST)
NetC66_1: C66.1 U35.1(BST)
NetD1_1: D1.1(C) R1.2
NetJ1_3: J1.3 U7.1 U7.2 U10.1 U10.2
NetJ1_5: J1.5 U8.1
NetJ1_6: J1.6 U8.2
NetJ1_7: J1.7 U11.1
NetJ1_8: J1.8 U11.2
NetL1_1: L1.1 U2.11(L1)
NetL1_2: L1.2 U2.9(L2)
NetR8_1: R8.1 U9.6(OUT)

Not connected (* = marked no-connect by the designer): J2 3(MNT_1)* 4(MNT_2)*; U2 2(PG)*; U3 1(PC14-OSC32_IN)* 2(PC15-OSC32_OUT)* 6(PA0)* 7(PA1)* 10(PA4)* 11(PA5)* 12(PA6)* 14(PB0)* 15(PB1)* 25(PB5)* 28(PB8)*; U4 1(PC14-OSC32_IN)* 2(PC15-OSC32_OUT)* 6(PA0)* 7(PA1)* 10(PA4)* 11(PA5)* 12(PA6)* 14(PB0)* 15(PB1)* 25(PB5)* 28(PB8)*; U28 1(PC14-OSC32_IN)* 2(PC15-OSC32_OUT)* 6(PA0)* 7(PA1)* 10(PA4)* 11(PA5)* 12(PA6)* 14(PB0)* 15(PB1)* 25(PB5)* 28(PB8)*; U29 1(PC14-OSC32_IN)* 2(PC15-OSC32_OUT)* 6(PA0)* 7(PA1)* 10(PA4)* 11(PA5)* 12(PA6)* 14(PB0)* 15(PB1)* 25(PB5) 28(PB8)*

### Notes on the sheet
- ESC 1
- ESC 2
- ESC2_A_EN
- ESC 3
- ESC 4
- (in symbol CMP-03017-000014-1) +

### Library data of the parts
C1-C3 C5-C8 C18-C25 = CMP-03422-001497-1: CAP CER 22UF 25V X5R 0805; Tolerance: 20%; Max Operating Temperature: 85°C; Dielectric: X5R; Termination: SMD/SMT; Voltage Rating: 25V; Width: 0.049inch; Min Operating Temperature: -55°C; Case/Package: 0805; Lead Free: Lead Free; RoHS Compliant: Yes; Weight: 0.000194oz; Voltage Rating (DC): 25V; Length: 0.079inch; Halogen Free: Halogen Free; Height: 1.25mm; Packaging: Tape and Reel; Package Quantity: 3000; Case Code (Metric): 2012; Thickness: 0.057inch; Case Code (Imperial): 0805; Mount: Surface Mount
C9 C10 C34 C35 C41 C43 C47 C48 C55 C57 C61 C62 = CMP-06035-026070-1: Chip Multilayer Ceramic Capacitors for General Purpose, 0402, 10uF, X5R, 15%, 20%, 10V
C11-C14 C36 C37 C42 C44 C49-C52 C56 C58 C63 C64 = CMP-2008-02972-1: Manufacturer: AVX Interconnect / Elco; Part Number: 04023C104JAT2A
C15 C16 = CMP-04427-011672-1: General Purpose Ceramic Capacitor, 1210, 2.2uF, 10%, X7R, 15%, 100V; Dissipation Factor: 2.5%; Features: Soft Termination; Series: FLEXITERM®; Min Operating Temperature: -55°C; Width: 2.5mm; Mount: Surface Mount; Case/Package: 1210; REACH SVHC: No SVHC; Voltage Rating (DC): 100V; Case Code (Metric): 3225; Depth: 2.5mm; Max Operating Temperature: 125°C; Dielectric: X7R; Construction: Flat; Contact Plating: Tin; Height: 2.79mm; Number of Pins: 2; Package Quantity: 1000; Packaging: Tape and Reel; Termination: SMD/SMT; Thickness: 0.037inch; Case Code (Imperial): 1210; Length: 3.2mm; Lead Free: Lead Free; Radiation Hardening: No; RoHS Compliant: Yes; Voltage Rating: 100V; Tolerance: 10%
C17 = CMP-1037-04978-1: CAP 10uF 16V -20% to +80% 1206 (3216 Metric) Thickness 1.9mm SMD; Case-EIA: 1206; Case-Metric: 3216; Tolerance: -20% to +80%; Technology: SMT; Rated Voltage: 16 V; Max Thickness: 1.9 mm
C26 = CMP-03017-000014-1: CAP TANT POLY 100UF 6.3V 1206; Tolerance: 20%; Life (Hours): 2000Hour; ESR (Equivalent Series Resistance): 45mR; Case Code (Metric): 3216; Features: General Purpose; Max Operating Temperature: 105°C; Case/Package: 1206; Case Code (Imperial): 1206; Min Operating Temperature: -55°C; Mount: Surface Mount; Voltage Rating: 6.3V; Packaging: Tape and Reel; RoHS Compliant: Yes
C27 = CMP-06035-013048-1: Chip Multilayer Ceramic Capacitors for General Purpose, 0805, 10uF, X5R, 15%, 20%, 25V; Max Operating Temperature: 85°C; Package Quantity: 3000; Case/Package: 0805; Depth: 1.25mm; Case Code (Imperial): 0805; Termination: SMD/SMT; Width: 0.049inch; Packaging: Tape and Reel; Tolerance: 20%; Height: 1.25mm; Min Operating Temperature: -55°C; Weight: 0.000335oz; Voltage Rating (DC): 25V; Dielectric: X5R; Length: 2mm; Thickness: 0.055inch; Voltage Rating: 25V; Resistor Type: Ceramic; Lead Free: Lead Free; Case Code (Metric): 2012; Mount: Surface Mount; REACH SVHC: No SVHC
C28 C29 = CMP-06035-022879-1: Chip Multilayer Ceramic Capacitors for General Purpose, 0603, 10uF, X5R, 15%, 10%, 25V
C30 C33 = CMP-1034-02073-1: CAP 100nF 25V ±20% 0402 (1005 Metric) Thickness 0.6mm SMD; Tolerance: Â±20%; Case-EIA: 0402; Case-Metric: 1005; Rated Voltage: 25 V; Max Thickness: 0.6 mm; Technology: SMT
C31 C32 C39 C40 C45 C46 C53 C54 C59 C60 C65 C66 = CMP-06035-005314-1: Cap Ceramic 0.1uF 16V X7R 20% Pad SMD 0603 Soft Termination +125°C Automotive T/R
C38 = CMP-2008-02109-2: CAP CER 10000PF 50V X7R 0402; Manufacturer: Kemet; Temperature Coefficient: 15%; Tolerance: 0.1; Value: 10,000 pF; Material: Ceramic; Device Class L3: Ceramic Capacitors; Digikey Description: CAP CER 10000PF 50V X7R 0402; Height: 0.55mm; Manufacturer Part Number: C0402C103K5RACTU; Temperature Range Low: -55°C; Package: C0402-BB; ComponentLink2URL: https://content.kemet.com/datasheets/KEM_C1002_X7R_SMD.pdf; Lead Free: Yes; Mouser Description: Capacitor; Ceramic; Cap; .010uF; Tol 10%; SMT; Vol-Rtg 50V; X7R; Tape and Reel; Ipc Land Pattern Name: CAPC10050X50; Temperature Range High: +125°C; Device Class L1: Passive Components; Category: Cap; Octopart: https://octopart.com/c0402c103k5ractu-kemet-95985; Temperature Characteristic: X7R; Automotive: No; Device Class L2: Capacitors; ComponentLink2Description: Datasheet; Voltage Rating: 50 V; Capacitance: 10,000 pF; RoHS: TRUE; Temperature: -55°C to +125°C
D1 = CMP-1744-00001-2: NexarPartId: 71131772; Color: White; Lens Color: Clear, White; Max Power Dissipation: 78mW; Lens Transparency: Diffused; Max Junction Temperature (Tj): 95°C; Number of Elements: 1; Forward Voltage: 3.6V; Viewing Angle: 140°; Current Rating: 300mA; Forward Current: 20mA; Reverse Voltage: 5V; Luminous Intensity: 200mcd; Max Operating Temperature: 85°C; Width: 800µm; Contact Plating: Gold, Silver; Height: 600µm; Case Code (Metric): 1608; Power Dissipation: 78mW; Power Rating: 78mW; Contact Material: Copper; Lens Style: Diffused; Depth: 800µm; Number of Pins: 2; Min Operating Temperature: -40°C; Mount: Surface Mount, Through Hole; Case Code (Imperial): 0603; Radiation Hardening: No; Lead Free: Lead Free; Test Current: 20mA; Length: 1.6mm; Number of LEDs: 1; Illumination Color: White; Case/Package: 0603; Packaging: Bulk; RoHS: Compliant; REACH SVHC: No SVHC
FB1 FB2 = CMP-0686-00596-3: Chip Ferrite Bead, 0603, 220Ω @ 100MHz, 25%, 0.04Ω, 2.5A; Impedance: 220R; DC Resistance-Max: 40mR; Number of Circuits: 1; Test Frequency: 100MHz; Material: Ferrite; Lead Free: Lead Free; Width: 0.8mm; Max Current Rating: 2.5A; Termination: SMD/SMT; Depth: 0.95mm; Packaging: Tape and Reel; Case Code (Metric): 1608; DC Current: 2.5A; Weight: 7.1E-05oz; Min Operating Temperature: -55°C; DC Resistance (DCR): 40mR; Max Operating Temperature: 125°C; Core Material: Ferrite; Max DC Current: 2.5A; Case/Package: 0603; REACH SVHC: No SVHC; Height: 0.8mm; Number of Pins: 2; Tolerance: 25%; RoHS Compliant: Yes; Radiation Hardening: No; Current Rating: 2.5A; Number of Lines: 1; Series: BLM18S; Case Code (Imperial): 0603; Length: 1.6mm; Package Quantity: 1
J1 = CMP-022-000000-1: Connector; Manufacturer_Part_Number: SM10B-SRSS-TB(LF)(SN); Manufacturer_Name: JST (JAPAN SOLDERLESS TERMINALS); Arrow Price/Stock: https://www.arrow.com/en/products/sm10b-srss-tb-lf-sn/jst-manufacturing?utm_currency=USD&region=europe; Datasheet Link: http://www.jst-mfg.com/product/pdf/eng/eSR.pdf; Mouser Price/Stock: https://www.mouser.co.uk/ProductDetail/JST-Commercial/SM10B-SRSS-TBLFSN?qs=QpmGXVUTftHkZAI%2F8hE40w%3D%3D; Arrow Part Number: SM10B-SRSS-TB(LF)(SN); Mouser Part Number: 306-SM10BSRSSTBLFSN; Design Item ID: SM10B-SRSS-TB_LF__SN_; Source: SM10B-SRSS-TB_LF__SN.SchLib
J2 = CMP-17439-000005-1: CONN HEADER SMD 2POS 2MM; Manufacturer Part Number: B2B-PH-SM4-TBT(LF)(SN); Manufacturer: JST; Current Rating: 2A; Voltage Rating: 100V; Conn Orientation: Vertical; Number Of Contacts: 2; Octopart: https://octopart.com/b2b-ph-sm4-tbt%28lf%29%28sn%29-jst-7877930; Number Of Rows: 1; Device Class L2: Headers and Wire Housings; RoHS: TRUE; Contact Material: Tin,Copper; Height: 6.65mm; Temperature: -25°C to +85°C; Conn Gender: Male; Temperature Range Low: -25°C; ComponentLink2Description: Datasheet; ComponentLink2URL: http://www.jst-mfg.com/product/pdf/eng/ePH.pdf; Automotive: No; Pitch: 2mm; Lead Free: Yes; Device Class L3: unset; Category: Conn; Digikey Description: CONN HEADER SMD 2POS 2MM; Temperature Range High: +85°C; Package: 0; Device Class L1: Connectors
J3-J14 = CMP-032-000000-1: Circuit Board Hardware - PCB STANDARD I.C. PIN; Manufacturer_Name: Mill-Max; Geometry.Height: 4.95mm; Datasheet Link: https://www.mill-max.com/products/printed-circuit-board-pcb-pin/surface-mount-pin/9931/9931-0-00-15-00-00-03-0?s_term=9931-0-00-15-00-00-03-0&s_type=Quick/Product/Part%20Number%20Search; Manufacturer_Part_Number: 9931-0-00-15-00-00-03-0; Mouser Price/Stock: *; Source: 9931-0-00-15-00-00-03-0.SchLib; Design Item ID: 9931-0-00-15-00-00-03-0; Mouser Part Number: *
L1 = CMP-06042-008194-1: Shielded Wirewound Inductor 0.82uH 20% 3600mA 0.035Ω 1008 (2520); Test Frequency: 1MHz; DC Resistance (DCR): 35mR; Inductance: 820nH; Saturation Current: 5.4A; Current Rating: 3.6A; Core Material: Ferrite; Height - Seated (Max): 0.047inch; Mount: Surface Mount; Case Code (Metric): 2520; Length: 0.098inch; Packaging: Tape and Reel; Case Code (Imperial): 1008; Tolerance: 20%; Max Operating Temperature: 125°C; Min Operating Temperature: -40°C; Case/Package: 1008; Shielding: Shielded; Width: 0.079inch
Q1-Q12 = CMP-008-000000-3: Dual N-Channel 30-V (D-S) MOSFETs Symm. PowerPAIR 3 x 3 1G sh ch , 5.5 m @ 10V m @ 7.5V 7.3 m @ 4.5V; Manufacturer_Name: Vishay; Geometry.Height: 0.8mm; Mouser Price/Stock: https://www.mouser.co.uk/ProductDetail/Vishay-Semiconductors/SIZ200DT-T1-GE3?qs=w%2Fv1CP2dgqrooJAcnSEylQ%3D%3D; Datasheet Link: https://www.vishay.com/docs/75033/siz200dt.pdf; Design Item ID: SIZ200DT-T1-GE3; Manufacturer_Part_Number: SIZ200DT-T1-GE3; Source: SIZ200DT-T1-GE3.SchLib; Mouser Part Number: 78-SIZ200DT-T1-GE3
R1 = CMP-02407-008466-1: RES SMD 1.2K OHM 1% 1/10W 0402; Max Power Dissipation: 100mW; Power Rating: 63mW; Voltage Rating (DC): 50V; Temperature Coefficient: 50ppm/°C; Max Operating Temperature: 125°C; Composition: Thin Film; REACH SVHC: No SVHC; Lead Free: Lead Free; Mount: Surface Mount; Weight: 2.1E-05oz; Package Quantity: 1; Length: 1mm; Case/Package: 0402; Number of Terminations: 2; Termination: SMD/SMT; Radiation Hardening: No; Case Code (Imperial): 0402; Case Code (Metric): 1005; Voltage Rating: 50V; Min Operating Temperature: -55°C; Tolerance: 1%; Packaging: Tape and Reel; Contact Plating: Tin; Width: 0.02inch; Height: 0.015inch; Military Standard: Not; Depth: 0.5mm
R2-R7 R16-R21 = CMP-03412-046811-1: RES 4.7kΩ ±1% 0.125W 0402; RoHS Compliant: Yes
R8 R10 R11 R22 R23 = CMP-03211-011410-1: RES SMD 10K OHM 1% 1/16W 0402; Voltage Rating (DC): 50V; Temperature Coefficient: 100ppm/°C; Max Power Dissipation: 63mW; Number of Resistors: 1; Max Operating Temperature: 125°C; Mount: Surface Mount; Length: 1mm; Lead Free: Lead Free; Min Operating Temperature: -55°C; Termination: Solder; Military Standard: Not; Width: 0.02inch; Case Code (Imperial): 0402; Construction: Rectangular; Resistance Tolerance: 1%; RoHS Compliant: Yes; Voltage Rating: 50V; Height: 0.35mm; Radiation Hardening: No; Depth: 0.5mm; Resistor Type: Thick Film; Number of Terminations: 2; Packaging: Tape and Reel; Series: CRG, Neohm; ELV: Compliant; Power Rating: 63mW; Case/Package: 0402; Technology: THICK FILM; Tolerance: 1%; REACH SVHC: No SVHC; Package Quantity: 10000
R9 = CMP-010-000000-1: RES SHUNT, 1206, 0.0005 ohm, 1%, 2W; Manufacturer_Name: Stackpole Electronics, Inc.; Geometry.Height: 1mm; Design Item ID: HCS1206FTL500; Mouser Part Number: 708-HCS1206FTL500; Source: HCS1206FTL500.SchLib; Manufacturer_Part_Number: HCS1206FTL500; Datasheet Link: https://cs.seielect.com/catalog/SEI-HCS.pdf; Mouser Price/Stock: https://www.mouser.co.uk/ProductDetail/SEI-Stackpole/HCS1206FTL500?qs=IPgv5n7u5QYgC9%252B5sPTgaQ%3D%3D
R12 R13 R24 R25 = CMP-010-000002-1: No Description Available; Manufacturer_Part_Number: RM2012B-103/103-PBVW10; Manufacturer_Name: Susumu; Design Item ID: RM2012B-103103-PBVW10; Source: RM2012B-103103-PBVW10.SchLib; Copyright: Copyright (C) 2025 Ultra Librarian. All rights reserved.
R14 R15 R26 R27 = CMP-010-000003-1: No Description Available; Manufacturer_Name: Bourns Electronics; Design Item ID: CAY10-222J4LF; Source: CAY10-222J4LF.SchLib; Manufacturer_Part_Number: CAY10-222J4LF; Copyright: Copyright (C) 2025 Ultra Librarian. All rights reserved.
U1 = CMP-0394-01495-2: Single Output Fast Transient Response LDO, 250 mA, Fixed 3.3 V Output, 2 to 5.5 V Input, with Ultra-Low IQ, 6-pin WSON (DSE), -40 to 125 degC, Green (RoHS & no Sb/Br); Manufacturer: Texas Instruments; Iout(Max)(A): 0.25; Vout Adj(Max)(V): 3.3; SubFamily: Single Channel LDO; Rating: Catalog; Vin(Min)(V): 2; Vin(Max)(V): 5.5; Vdo(Typ)(mV): 130; Iq(Typ)(mA): 0.008; PartNumber: TPS72733DSER; DatasheetVersion: SBVS128C; ComponentLink1URL: http://www.ti.com/; ComponentLink3URL: http://www.ti.com/litv/pdf/mpds287; PackageReference: DES0006A; PackageDescription: 6-Pin Plastic Small Outline, Body 1.5 x 1.5 mm, Pitch 0.5 mm; ComponentLink2Description: Datasheet; Mounting Technology: Surface Mount; PackageVersion: 4207810/A; ComponentLink2URL: http://www.ti.com/general/docs/lit/getliterature.tsp?genericPartNumber=TPS72733&fileType=pdf; Vout Adj(Min)(V): 3.3; Fixed Output Options(V): 3.3; Eco-Plan: Green (RoHS & no Sb/Br); ComponentLink1Description: Manufacturer URL; Accuracy(%): 2; ComponentLink3Description: Package Specification
U2 = CMP-04918-000613-1: IC REG BCK BST 5V 2A 15VQFN; Min Input Voltage: 2V; Max Input Voltage: 16V; Switching Frequency: 2.4MHz; Number of Outputs: 1; Output Configuration: Positive; Synchronous Rectifier: Yes; Output Type: Fixed; Quiescent Current: 50uA; Topology: Buck-Boost; Min Output Voltage: 5V; RoHS Compliant: Yes; Case/Package: VQFN; Max Operating Temperature: 125°C; Output Current: 2A; Lead Free: Lead Free; Min Operating Temperature: -40°C; Number of Pins: 15; Mount: Surface Mount; Packaging: Cut Tape
U3 U4 U28 U29 = CMP-12105-000098-1: IC MCU 32BIT 128KB FLSH 28UFQFPN; Frequency: 64MHz; Interface: I2C; Core Architecture: ARM; Memory Type: FLASH; Peripherals: Brown-out Detect/Reset; Oscillator Type: Internal; Number of I/Os: 26; Min Operating Temperature: -40°C; Number of Pins: 28; Memory Size: 128KB; Max Operating Temperature: 85°C; Packaging: Tray; Case/Package: UFQFPN; RoHS Compliant: Yes
U5 U6 U12 U13 U24 U25 U30-U35 = CMP-005-000001-1: No Description Available; Manufacturer_Name: onsemi; Type: Type; Manufacturer_Part_Number: NCP81161MNTBG; Design Item ID: NCP81161MNTBG; Source: NCP81161MNTBG.SchLib; Copyright: Copyright (C) 2025 Ultra Librarian. All rights reserved.; RefDes: RefDes
U7 U8 U10 U11 = CMP-018-000000-2: No Description Available; Manufacturer_Name: Panasonic; Source: EXB24V102JX.SchLib; RefDes: RefDes; Design Item ID: EXB24V102JX; Copyright: Copyright (C) 2025 Ultra Librarian. All rights reserved.; Manufacturer_Part_Number: EXB24V102JX; Type: Type
U9 = CMP-04895-000427-1: IC CURR SENSE 1 CIRCUIT SC70-6
U14-U23 U26 U27 = CMP-020-000000-2: No Description Available; Manufacturer_Name: Panasonic; Source: EXB24V100JX.SchLib; Copyright: Copyright (C) 2025 Ultra Librarian. All rights reserved.; RefDes: RefDes; Manufacturer_Part_Number: EXB24V100JX; Design Item ID: EXB24V100JX; Type: Type
X1-X4 = CMP-010-000001-1: Resistor Networks & Arrays 2.2Kohms 5% Isolated; Manufacturer_Name: CTS; Geometry.Height: 0.45mm; Source: 741X043222JP.SchLib; Design Item ID: 741X043222JP; Mouser Price/Stock: https://www.mouser.co.uk/ProductDetail/CTS-Electronic-Components/741X043222JP/?qs=hbgUSdfWRJU00WOzIBhPow%3D%3D; Mouser Part Number: 774-741X043222JP; Manufacturer_Part_Number: 741X043222JP; Datasheet Link: https://www.ctscorp.com/wp-content/uploads/74x.pdf